# Altium schematic sheet Control_Module_IO.SchDoc: Módulo de Control - Entradas/Salidas
size A4; Author: Martin C.A. Yunis; CompanyName: Sistema de Control de Acceso; Revision: V1; SheetNumber: 7; SheetTotal: 7
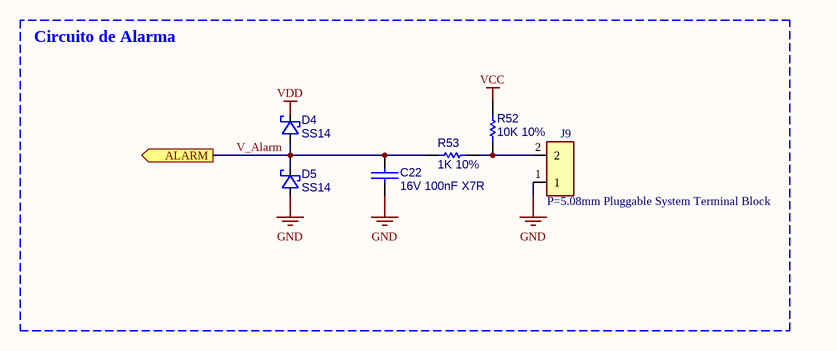
[diagram p0: Control_Module_IO.SchDoc]

## Parts
C22  16V 100nF X7R  [CAP0402]
D4  SS14  [D_SMA]
D5  SS14  [D_SMA]
J9  P=5.08mm Pluggable System Terminal Block  [TerminalBlock_1x2_P5mm]
R52  10K 10%  [RES0402]
R53  1K 10%  [RES0402]

## Blocks framed on the sheet
Circuito de Alarma: C22 D4 D5 J9 R52 R53

## Ports
ALARM (out, see Control_Module_MAIN[3A], Control_Module_CPU[1B])

## Nets
GND: C22.2 D5.1(A) J9.1
VCC: R52.1
VDD: D4.2(K)
V_Alarm: C22.1 D4.1(A) D5.2(K) R53.1 ; port ALARM
NetJ9_2: J9.2 R52.2 R53.2

## Notes on the sheet
- Title:
- Size:
- Author:
- A4
- Sheet
- of
- Revision:
- File:
- Date:

## Library data of the parts
C22 = CAP: Non Polarized Capacitor; MANUF P/N: CL05B104KO5NNNC; JLCPCB P/N: C1525
D4 D5 = DIODO_SH: Diode Shottky; MANUF P/N: SS14; JLCPCB P/N: C2480
J9 = CONN_2P: Alarm Connector; MANUF P/N: WJ2EDGRC-5.08-2P; JLCPCB P/N: C3697,C8414; JLCPCB P/N 2: C8414
R52 = Res1: Resistor; MANUF P/N: CRCW040210K0FKED; JLCPCB P/N: C71617
R53 = Res1: Resistor; MANUF P/N: CRCW04021K00FKED; JLCPCB P/N: C71623